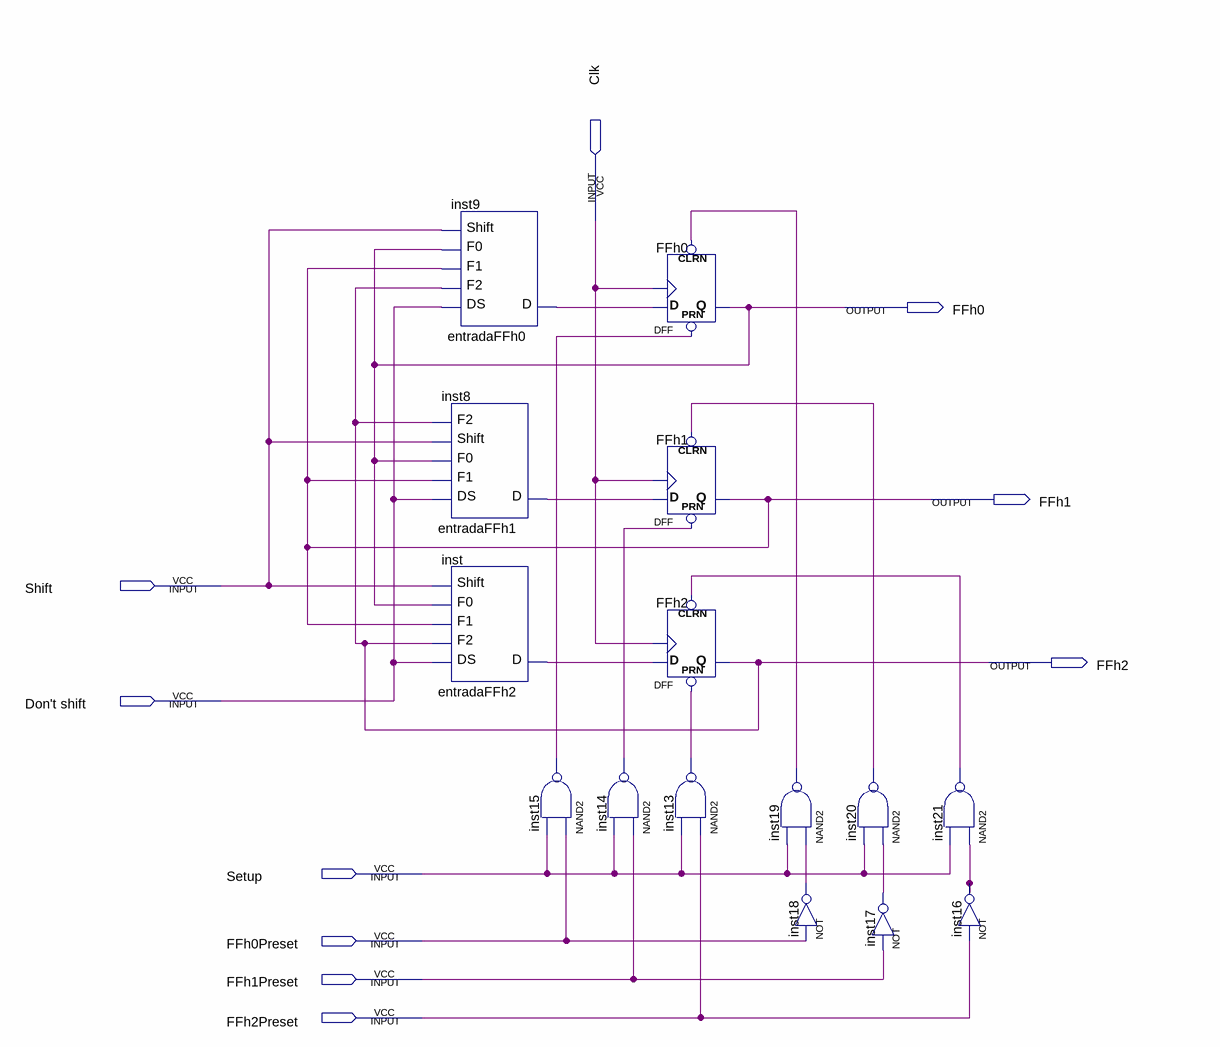
[diagram p0: schematic sheet]
// Quartus schematic PosicaoHorizontalAlien.bdf as structural Verilog: 15 symbols, 10 pins
module PosicaoHorizontalAlien (
  input  Clk,
  input  Shift,
  input  \Don't_shift ,
  input  Setup,
  input  FFh0Preset,
  input  FFh1Preset,
  input  FFh2Preset,
  output FFh0,
  output FFh1,
  output FFh2
);

  wire inst8_d, inst9_d, inst13_out, inst14_out, inst15_out, inst16_out, inst17_out, inst18_out, inst19_out,
       inst20_out, inst21_out, inst_d;

  entradaFFh0 inst9 (.DS(\Don't_shift ), .F2(FFh2), .F1(FFh1), .F0(FFh0), .Shift(Shift), .D(inst9_d));
  entradaFFh1 inst8 (.DS(\Don't_shift ), .F1(FFh1), .F0(FFh0), .Shift(Shift), .F2(FFh2), .D(inst8_d));
  entradaFFh2 inst (.DS(\Don't_shift ), .F2(FFh2), .F1(FFh1), .F0(FFh0), .Shift(Shift), .D(inst_d));
  nand inst15 (inst15_out, FFh0Preset, Setup);
  nand inst14 (inst14_out, FFh1Preset, Setup);
  DFF u_FFh0 (.CLRN(inst19_out), .CLK(Clk), .D(inst9_d), .PRN(inst15_out), .Q(FFh0));
  DFF u_FFh1 (.CLRN(inst20_out), .CLK(Clk), .D(inst8_d), .PRN(inst14_out), .Q(FFh1));
  DFF u_FFh2 (.CLRN(inst21_out), .CLK(Clk), .D(inst_d), .PRN(inst13_out), .Q(FFh2));
  nand inst13 (inst13_out, FFh2Preset, Setup);
  nand inst19 (inst19_out, inst18_out, Setup);
  nand inst20 (inst20_out, inst17_out, Setup);
  not inst18 (inst18_out, FFh0Preset);
  not inst17 (inst17_out, FFh1Preset);
  nand inst21 (inst21_out, inst16_out, Setup);
  not inst16 (inst16_out, FFh2Preset);
endmodule
